# EasyEDA Pro project mikroprosesor Praktek.eprj

# Schematic Schematic1
Board Name: Board1; Create Date: 2025-10-18; Page Name: P1; Project Name: mikroprosesor; Schematic Name: Schematic1; Update Date: 2025-10-18; Company: EasyEDA.com; Page Size: A4; Version: V1.0
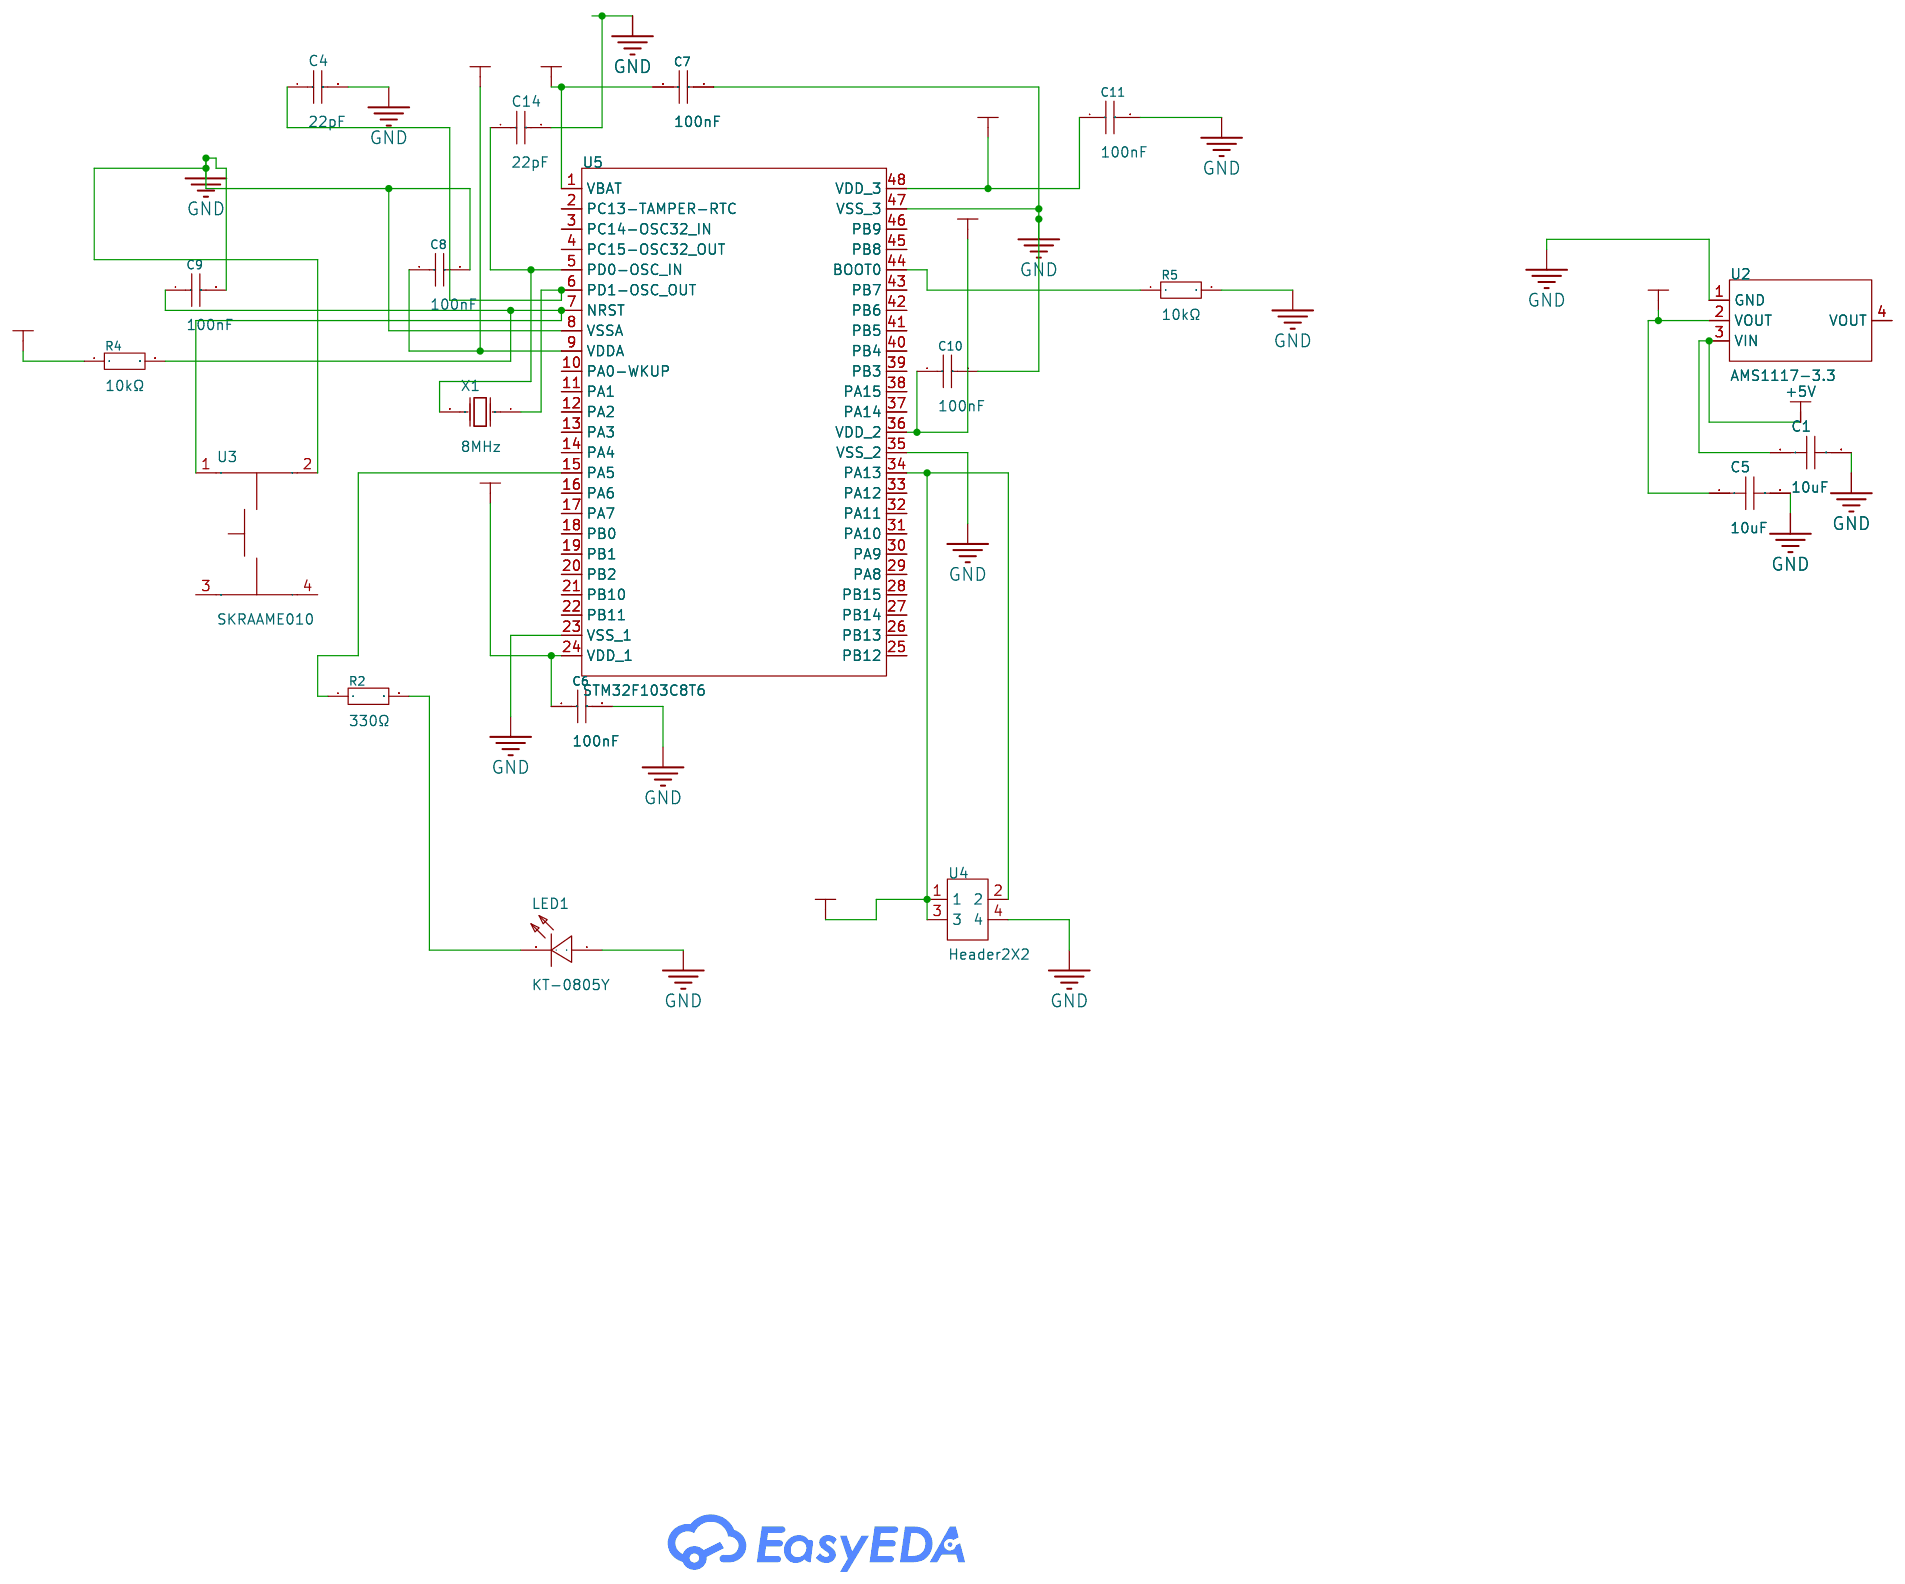
[diagram p0: schematic sheet]

## Parts
C1  10uF  [C0805]
C4  22pF  [C0805]
C5  10uF  [C0805]
C6  100nF  [C1206]
C7  100nF  [C1206]
C8  100nF  [C1206]
C9  100nF  [C1206]
C10  100nF  [C1206]
C11  100nF  [C1206]
C14  22pF  [C0805]
LED1  KT-0805Y  [LED0805-R-RD]
R2  330Ω  [R0805]
R4  10kΩ  [R1206]
R5  10kΩ  [R1206]
U2  AMS1117-3.3  [SOT-223-3_L6.5-W3.4-P2.30-LS7.0-BR]
U3  SKRAAME010  [SW-SMD_4P-L6.2-W6.2-P4.00-LS6.8]
U4  Header2X2  [HDR-SMD_4P-P1.27-V-M-R2-C2-LS5.3]
U5  STM32F103C8T6  [LQFP-48_L7.0-W7.0-P0.50-LS9.0-BL]
X1  8MHz  [CRYSTAL-SMD_L5.0-W3.2]

## Library data of the parts
C1 C5 = CL21A106KAYNNNE_C15850: Capacitance:10uF Tolerance:±10% Tolerance:±10% Voltage Rating:25V Temperature Coefficient:X5R; LCSC Part Name: 10uF ±10% 25V; Supplier Part: C15850; Manufacturer: SAMSUNG(三星); Manufacturer Part: CL21A106KAYNNNE; Supplier Footprint: 0805; JLCPCB Part Class: Basic Part; Datasheet: https://item.szlcsc.com/datasheet/CL21A106KAYNNNE/16532.html; Supplier: LCSC; Tolerance: ±10%; Voltage Rating: 25V; Temperature Coefficient: X5R
C4 C14 = CL21C220JBANNNC: Capacitance:22pF Tolerance:±5% Tolerance:±5% Voltage Rating:50V Temperature Coefficient:C0G; LCSC Part Name: 22pF ±5% 50V; Supplier Part: C1804; Manufacturer: SAMSUNG(三星); Supplier Footprint: 0805; JLCPCB Part Class: Basic Part; Datasheet: https://item.szlcsc.com/datasheet/CL21C220JBANNNC/2156.html; Supplier: LCSC; Tolerance: ±5%; Voltage Rating: 50V; Temperature Coefficient: C0G
C6-C11 = CL31B104KBCNNNC: Capacitance:100nF Tolerance:±10% Tolerance:±10% Voltage Rating:50V Temperature Coefficient:X7R; LCSC Part Name: 100nF ±10% 50V; Supplier Part: C24497; Manufacturer: SAMSUNG(三星); Supplier Footprint: 1206; JLCPCB Part Class: Basic Part; Datasheet: https://item.szlcsc.com/datasheet/CL31B104KBCNNNC/25237.html; Supplier: LCSC; Tolerance: ±10%; Voltage Rating: 50V; Temperature Coefficient: X7R
LED1 = KT-0805Y: Illumination Color:Yellow Voltage - Forward(Vf):1.8V~2.4V Voltage - Forward(Vf):1.8V~2.4V Power(Watts):40mW Forward Current:- Wavelength - Dominant:584nm~594nm Wavelength - Dominant:584nm~594nm Peak Wavelength:596nm Diode Configuration:- Lens Color:Water; LCSC Part Name: 0805 黄灯 高亮; Supplier Part: C2296; Manufacturer: KENTO; Supplier Footprint: 0805; JLCPCB Part Class: Basic Part; Datasheet: https://item.szlcsc.com/datasheet/KT-0805Y/2669.html; Supplier: LCSC; Illumination Color: Yellow; Voltage - Forward(Vf): 1.8V~2.4V; Power(Watts): 40mW; Wavelength - Dominant: 584nm~594nm; Peak Wavelength: 596nm; Lens Color: Water Clear; Luminous Intensity: 175mcd; Viewing Angle: 120°; Operating Temperature: -40℃~+85℃
R2 = 0805W8F3300T5E: Type:Thick Film Resistor Resistance:330Ω Tolerance:±1% Tolerance:±1% Power(Watts):125mW Voltage-Supply(Max):150V Temperature Coefficient:±100ppm/℃ Temperature Coefficient:±100ppm/℃ Operating Temperature:-55℃~+155℃ Operating Temperature:-55℃~+155℃; LCSC Part Name: 330Ω ±1% 125mW 厚膜电阻; Supplier Part: C17630; Manufacturer: UNI-ROYAL(厚声); Supplier Footprint: 0805; JLCPCB Part Class: Basic Part; Datasheet: https://item.szlcsc.com/datasheet/0805W8F3300T5E/18318.html; Supplier: LCSC; Type: Thick Film Resistor; Tolerance: ±1%; Power(Watts): 125mW; Voltage-Supply(Max): 150V; Temperature Coefficient: ±100ppm/℃; Operating Temperature: -55℃~+155℃
R4 R5 = 1206W4F1002T5E: Type:Thick Film Resistor Resistance:10kΩ Tolerance:±1% Tolerance:±1% Power(Watts):250mW Voltage-Supply(Max):200V Temperature Coefficient:±100ppm/℃ Temperature Coefficient:±100ppm/℃ Operating Temperature:-55℃~+155℃ Operating Temperature:-55℃~+155℃; LCSC Part Name: 10kΩ ±1% 250mW 厚膜电阻; Supplier Part: C17902; Manufacturer: UNI-ROYAL(厚声); Supplier Footprint: 1206; JLCPCB Part Class: Basic Part; Datasheet: https://item.szlcsc.com/datasheet/1206W4F1002T5E/18590.html; Supplier: LCSC; Type: Thick Film Resistor; Tolerance: ±1%; Power(Watts): 250mW; Voltage-Supply(Max): 200V; Temperature Coefficient: ±100ppm/℃; Operating Temperature: -55℃~+155℃
U2 = AMS1117-3.3_C6186: Output Type:Fixed Voltage - Supply:16V Output Voltage:3.3V Output Voltage:3.3V Output Current:1A Power Supply Rejection Ratio (PSRR):72dB@(120Hz) Voltage Dropout:1.1V@(800mA) standby current:5mA Noise:- Features:Over Current Protection；Over Temperature Pr; LCSC Part Name: 输出3.3V 1A; Supplier Part: C6186; Manufacturer: AMS; Supplier Footprint: SOT-223; JLCPCB Part Class: Basic Part; Datasheet: https://item.szlcsc.com/datasheet/AMS1117-3.3/6652.html; Supplier: LCSC; Output Type: Fixed; Voltage - Supply: 16V; Output Voltage: 3.3V; Output Current: 1A; Power Supply Rejection Ratio (PSRR): 72dB@(120Hz); Voltage Dropout: 1.1V@(800mA); standby current: 5mA; Features: Over Current Protection；Over Temperature Protection; Operating Temperature: -40℃~+125℃; Output Configuration: Positive; Number of Outputs: 1
U3 = SKRAAME010_C9900007833: Supplier Part: C9900007833; Supplier Footprint: SWPUSHBUTTON-SPST-2_SKRAAME010; JLCPCB Part Class: Extended Part; Supplier: LCSC
U4 = Header2X2: Supplier Part: C9900013643; JLCPCB Part Class: Extended Part; Supplier: LCSC
U5 = STM32F103C8T6: CPU Core:ARM-M3 CPU Maximum Speed:72MHz Program Storage Size:64KB Program Memory Type:FLASH Number of I/O:37 ADC (Bit):12bit Voltage - Supply:2V~3.6V Voltage - Supply:2V~3.6V Applications:-; LCSC Part Name: 主流增强型ARM Cortex-M3 MCU，具有64 KB Flash、72 MHz CPU、电机控制、USB和CAN; Supplier Part: C8734; Manufacturer: ST(意法半导体); Supplier Footprint: LQFP-48(7x7); JLCPCB Part Class: Extended Part; Datasheet: https://item.szlcsc.com/datasheet/STM32F103C8T6/9243.html; Supplier: LCSC; CPU Core: ARM-M3; CPU Maximum Speed: 72MHz; Program Storage Size: 64KB; Program Memory Type: FLASH; Number of I/O: 37; ADC (Bit): 12bit; Voltage - Supply: 2V~3.6V
X1 = X50328MSB2GI: Type:Crystal Oscillator Frequency:8MHz Normal temperature Frequency Tolerance:±10ppm Normal temperature Frequency Tolerance:±10ppm Load Capacitance:20pF Frequency Stability:±20ppm Frequency Stability:±20ppm Operating Temperature:-40℃~+85℃ Operating Temper; LCSC Part Name: YSX530GA 8MHZ 2P 5032 20PF ±10PPM -40~85℃ (±20PPM); Supplier Part: C115962; Manufacturer: YXC(扬兴晶振); Supplier Footprint: SMD5032-2P; JLCPCB Part Class: Basic Part; Datasheet: https://item.szlcsc.com/datasheet/X50328MSB2GI/117214.html; Supplier: LCSC; Type: Crystal Oscillator; Normal temperature Frequency Tolerance: ±10ppm; Load Capacitance: 20pF; Frequency Stability: ±20ppm; Operating Temperature: -40℃~+85℃

## Nets
+3.3V: C5.1 C6.1 C7.1 C8.1 C10.1 C11.1 R4.1 U2.2(VOUT) U4.1 U4.2 U4.3 U5.1(VBAT) U5.9(VDDA) U5.24(VDD_1) U5.34(PA13) U5.36(VDD_2) U5.48(VDD_3)
+5V: C1.1 U2.3(VIN)
GND: C1.2 C4.2 C5.2 C6.2 C7.2 C8.2 C9.2 C10.2 C11.2 C14.2 LED1.1(+) R5.2 U2.1(GND) U3.2 U4.4 U5.8(VSSA) U5.23(VSS_1) U5.35(VSS_2) U5.47(VSS_3)
Net-(C4-1): C4.1 U5.6(PD1-OSC_OUT) X1.1(OSC1)
Net-(C9-1): C9.1 R4.2 U3.1 U5.7(NRST)
Net-(C14-1): C14.1 U5.5(PD0-OSC_IN) X1.2(OSC2)
Net-(LED1-2): LED1.2(-) R2.2
Net-(R2-1): R2.1 U5.15(PA5)
Net-(R5-1): R5.1 U5.44(BOOT0)

Not connected (* = marked no-connect by the designer): U2 4(VOUT); U3 3 4; U5 2(PC13-TAMPER-RTC) 3(PC14-OSC32_IN) 4(PC15-OSC32_OUT) 10(PA0-WKUP) 11(PA1) 12(PA2) 13(PA3) 14(PA4) 16(PA6) 17(PA7) 18(PB0) 19(PB1) 20(PB2) 21(PB10) 22(PB11) 25(PB12) 26(PB13) 27(PB14) 28(PB15) 29(PA8) 30(PA9) 31(PA10) 32(PA11) 33(PA12) 37(PA14) 38(PA15) 39(PB3) 40(PB4) 41(PB5) 42(PB6) 43(PB7) 45(PB8) 46(PB9)

# Schematic Schematic2
Create Date: 2025-10-18; Page Name: P1; Project Name: mikroprosesor; Schematic Name: Schematic2; Update Date: 2025-10-18; Company: EasyEDA.com; Page Size: A4; Version: V1.0
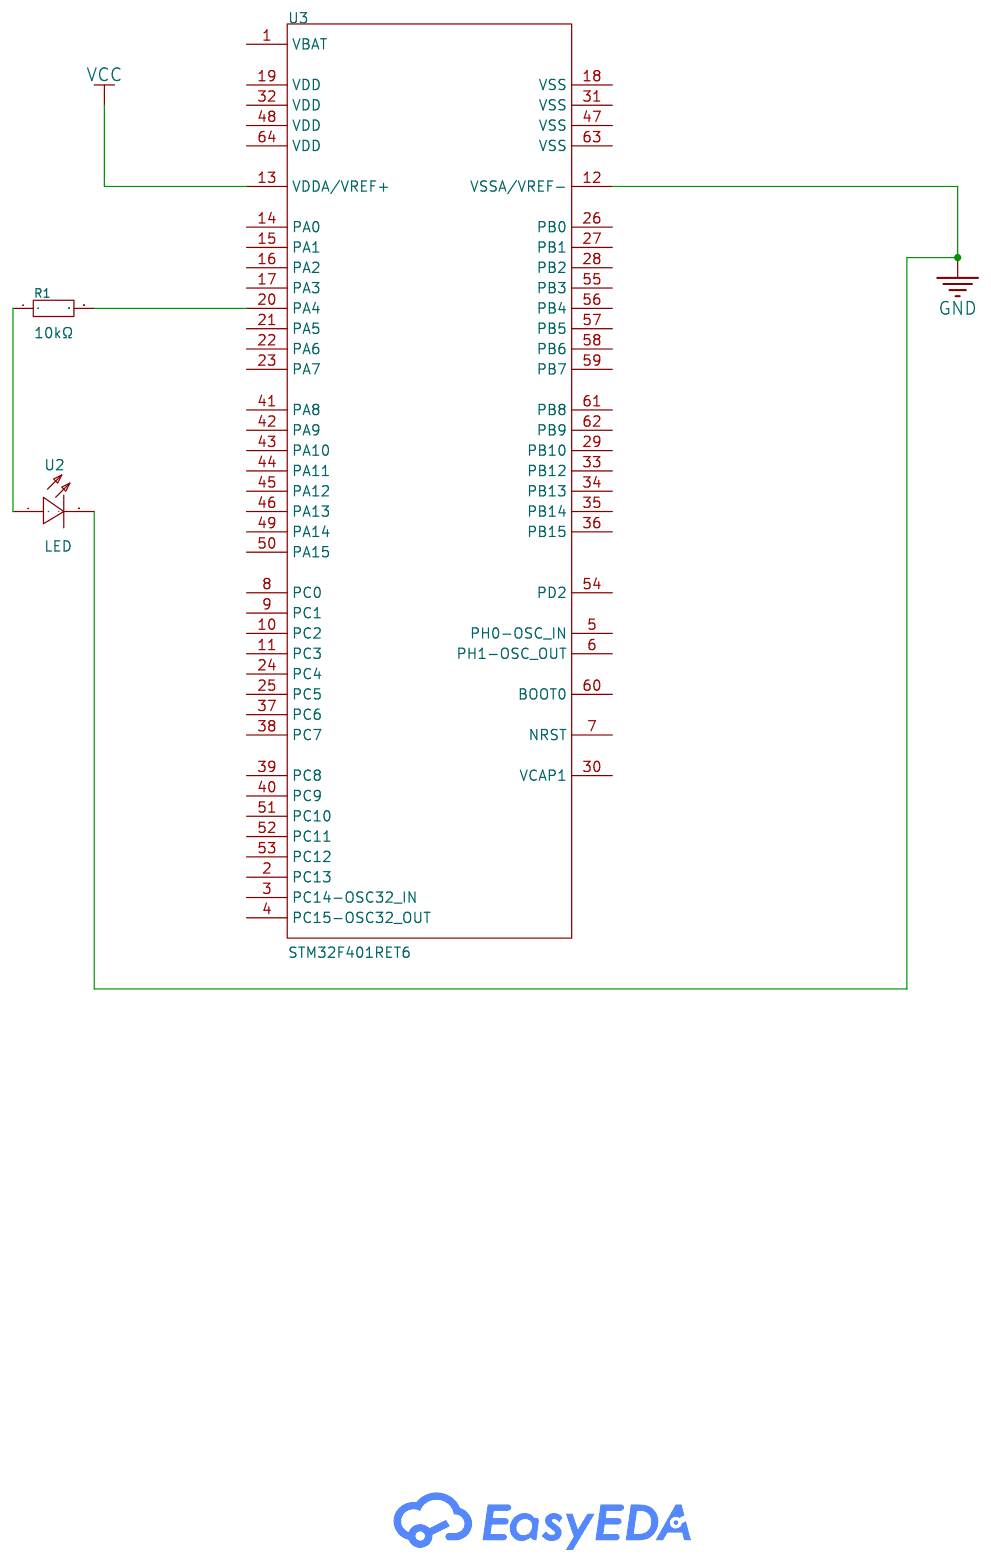
[diagram p1: schematic sheet]

## Parts
R1  10kΩ  [R1206]
U2  LED  [LED-TH_BD4.0-P2.54-FD_RED]
U3  STM32F401RET6  [LQFP-64_L10.0-W10.0-P0.50-LS12.0-BL]

## Library data of the parts
R1 = 1206W4F1002T5E: Type:Thick Film Resistor Resistance:10kΩ Tolerance:±1% Tolerance:±1% Power(Watts):250mW Voltage-Supply(Max):200V Temperature Coefficient:±100ppm/℃ Temperature Coefficient:±100ppm/℃ Operating Temperature:-55℃~+155℃ Operating Temperature:-55℃~+155℃; LCSC Part Name: 10kΩ ±1% 250mW 厚膜电阻; Supplier Part: C17902; Manufacturer: UNI-ROYAL(厚声); Supplier Footprint: 1206; JLCPCB Part Class: Basic Part; Datasheet: https://item.szlcsc.com/datasheet/1206W4F1002T5E/18590.html; Supplier: LCSC; Type: Thick Film Resistor; Tolerance: ±1%; Power(Watts): 250mW; Voltage-Supply(Max): 200V; Temperature Coefficient: ±100ppm/℃; Operating Temperature: -55℃~+155℃
U2 = LED: Supplier Part: C9900015665; Supplier Footprint: SIP-2P; JLCPCB Part Class: Extended Part; Supplier: LCSC
U3 = STM32F401RET6: CPU Core:ARM-M4 CPU Maximum Speed:84MHz Program Storage Size:512KB Number of I/O:50 ADC (Bit):12bit Voltage - Supply:1.7V~3.6V Voltage - Supply:1.7V~3.6V Applications:-; LCSC Part Name: 带DSP和FPU的STM32动态效率ARM Cortex-M4 MCU，具有最大512 KB Flash、84 MHz CPU和ART加速器; Supplier Part: C116978; Manufacturer: ST(意法半导体); Supplier Footprint: LQFP-64(10x10); JLCPCB Part Class: Extended Part; Datasheet: https://atta.szlcsc.com/upload/public/pdf/source/20180130/C161736_15172973410651323369.pdf; Supplier: LCSC; CPU Core: ARM-M4; CPU Maximum Speed: 84MHz; Program Storage Size: 512KB; Number of I/O: 50; ADC (Bit): 12bit; Voltage - Supply: 1.7V~3.6V

## Nets
GND: U2.2(-) U3.12(VSSA/VREF-)
VCC: U3.13(VDDA/VREF+)
Net-(R1-1): R1.1 U2.1(+)
Net-(R1-2): R1.2 U3.20(PA4)

Not connected (* = marked no-connect by the designer): U3 1(VBAT) 2(PC13) 3(PC14-OSC32_IN) 4(PC15-OSC32_OUT) 5(PH0-OSC_IN) 6(PH1-OSC_OUT) 7(NRST) 8(PC0) 9(PC1) 10(PC2) 11(PC3) 14(PA0) 15(PA1) 16(PA2) 17(PA3) 18(VSS) 19(VDD) 21(PA5) 22(PA6) 23(PA7) 24(PC4) 25(PC5) 26(PB0) 27(PB1) 28(PB2) 29(PB10) 30(VCAP1) 31(VSS) 32(VDD) 33(PB12) 34(PB13) 35(PB14) 36(PB15) 37(PC6) 38(PC7) 39(PC8) 40(PC9) 41(PA8) 42(PA9) 43(PA10) 44(PA11) 45(PA12) 46(PA13) 47(VSS) 48(VDD) 49(PA14) 50(PA15) 51(PC10) 52(PC11) 53(PC12) 54(PD2) 55(PB3) 56(PB4) 57(PB5) 58(PB6) 59(PB7) 60(BOOT0) 61(PB8) 62(PB9) 63(VSS) 64(VDD)
